# EAGLE design hbridge (EAGLE 7.4.0)
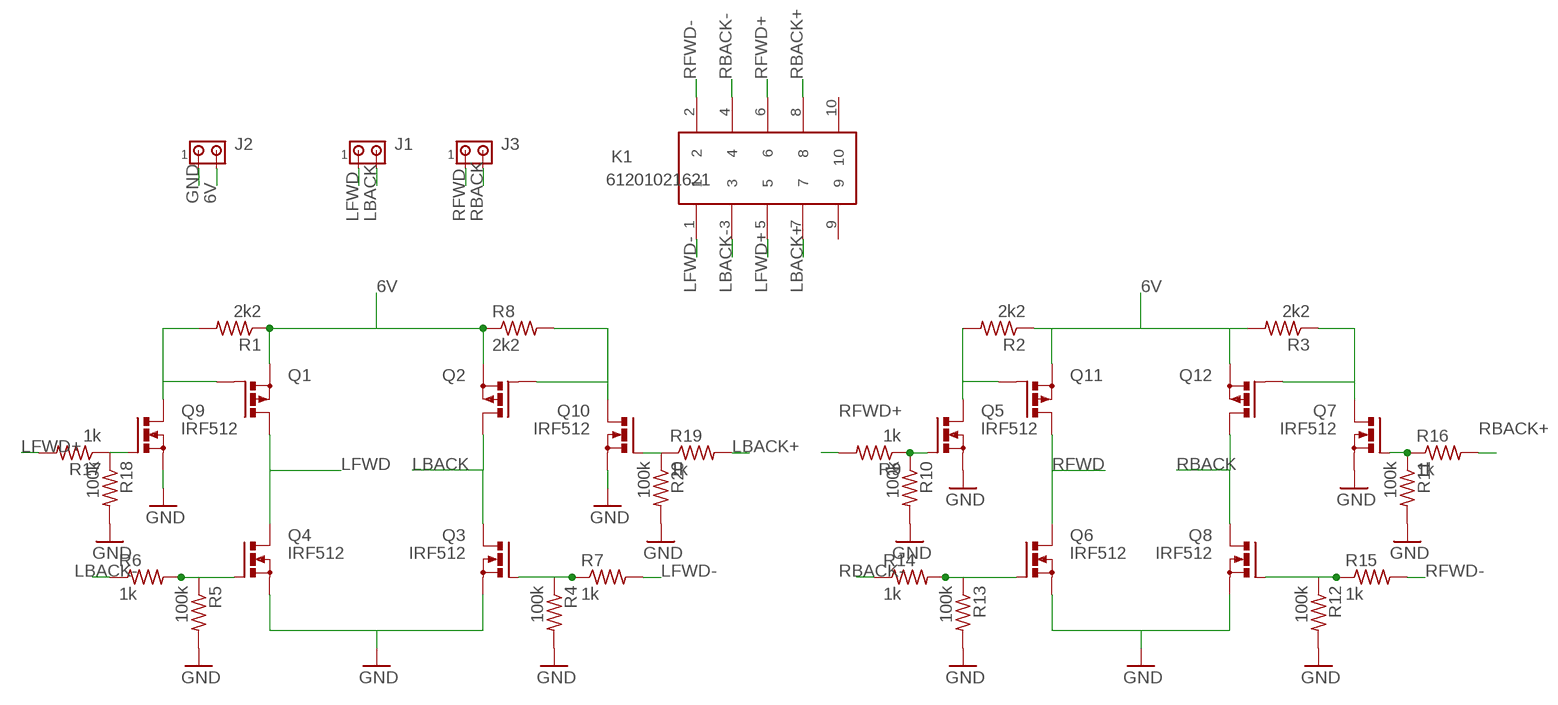
[diagram p0: schematic, sheet 1]

## Parts
J1  MTA02-100  [10X02MTA]
J2  MTA02-100  [10X02MTA]
J3  MTA02-100  [10X02MTA]
K1  61201021621  [61201021621]
Q1  PMOSFET_PTO220BV  [TO220BV]
Q2  PMOSFET_PTO220BV  [TO220BV]
Q3  IRF512  [TO220BV]
Q4  IRF512  [TO220BV]
Q5  IRF512  [TO220BV]
Q6  IRF512  [TO220BV]
Q7  IRF512  [TO220BV]
Q8  IRF512  [TO220BV]
Q9  IRF512  [TO220BV]
Q10  IRF512  [TO220BV]
Q11  PMOSFET_PTO220BV  [TO220BV]
Q12  PMOSFET_PTO220BV  [TO220BV]
R1  2k2  R-US_0204/7  [0204/7]
R2  2k2  R-US_0204/7  [0204/7]
R3  2k2  R-US_0204/7  [0204/7]
R4  100k  R-US_0204/7  [0204/7]
R5  100k  R-US_0204/7  [0204/7]
R6  1k  R-US_0204/7  [0204/7]
R7  1k  R-US_0204/7  [0204/7]
R8  2k2  R-US_0204/7  [0204/7]
R9  1k  R-US_0204/7  [0204/7]
R10  100k  R-US_0204/7  [0204/7]
R11  100k  R-US_0204/7  [0204/7]
R12  100k  R-US_0204/7  [0204/7]
R13  100k  R-US_0204/7  [0204/7]
R14  1k  R-US_0204/7  [0204/7]
R15  1k  R-US_0204/7  [0204/7]
R16  1k  R-US_0204/7  [0204/7]
R17  1k  R-US_0204/7  [0204/7]
R18  100k  R-US_0204/7  [0204/7]
R19  1k  R-US_0204/7  [0204/7]
R20  100k  R-US_0204/7  [0204/7]

## Nets
6V: J2.2 Q1.S Q2.S Q11.S Q12.S R1.1 R2.1 R3.2 R8.1
GND: J2.1 Q3.S Q4.S Q5.S Q6.S Q7.S Q8.S Q9.S Q10.S R4.2 R5.2 R10.2 R11.2 R12.2 R13.2 R18.2 R20.2
LBACK: J1.2 Q2.D Q3.D
LBACK+: K1.7 R19.2
LBACK-: K1.3 R6.1
LFWD: J1.1 Q1.D Q4.D
LFWD+: K1.5 R17.2
LFWD-: K1.1 R7.2
N$1: Q3.G R4.1 R7.1
N$2: Q2.G Q10.D R8.2
N$3: Q4.G R5.1 R6.2
N$4: Q1.G Q9.D R1.2
N$5: Q8.G R12.1 R15.1
N$6: Q7.G R11.1 R16.1
N$7: Q6.G R13.1 R14.2
N$8: Q5.G R9.1 R10.1
N$9: Q5.D Q11.G R2.2
N$10: Q10.G R19.1 R20.1
N$11: Q9.G R17.1 R18.1
N$12: Q7.D Q12.G R3.1
RBACK: J3.2 Q8.D Q12.D
RBACK+: K1.8 R16.2
RBACK-: K1.4 R14.1
RFWD: J3.1 Q6.D Q11.D
RFWD+: K1.6 R9.2
RFWD-: K1.2 R15.2
Unconnected: K1.9 K1.10

## Library data of the parts
J1-J3 = con-amp:MTA02-100: AMP connector
K1 = Wurth_Elektronik_Electromechanic_Wire_to_Board_Connectors_rev15c:61201021621: WR-BHD 2.54mm Male Box Header, 10 Pins=>Code : Con_WTB_BHD_2.54_Male_THT_WS_61201021621 <http://katalog.we-online.de/media/thumbs2/eican/thb_Con_WTB_BHD_2.54_Male_THT_WS_6120xx21621_pf2.jpg> Details see: http://katalog.we-online.de/en/em/612_0xx_216_21 Created 2014-06-04, Karrer Zheng 2014 (C) Würth Elektronik
Q1 Q2 Q11 Q12 = transistor-power:PMOSFET_P: Power MOSFET P-Channel
Q3-Q10 = transistor-power:IRF512: N-CHANNEL MOS FET
R1-R20 = rcl:R-US_: RESISTOR, American symbol

## Board
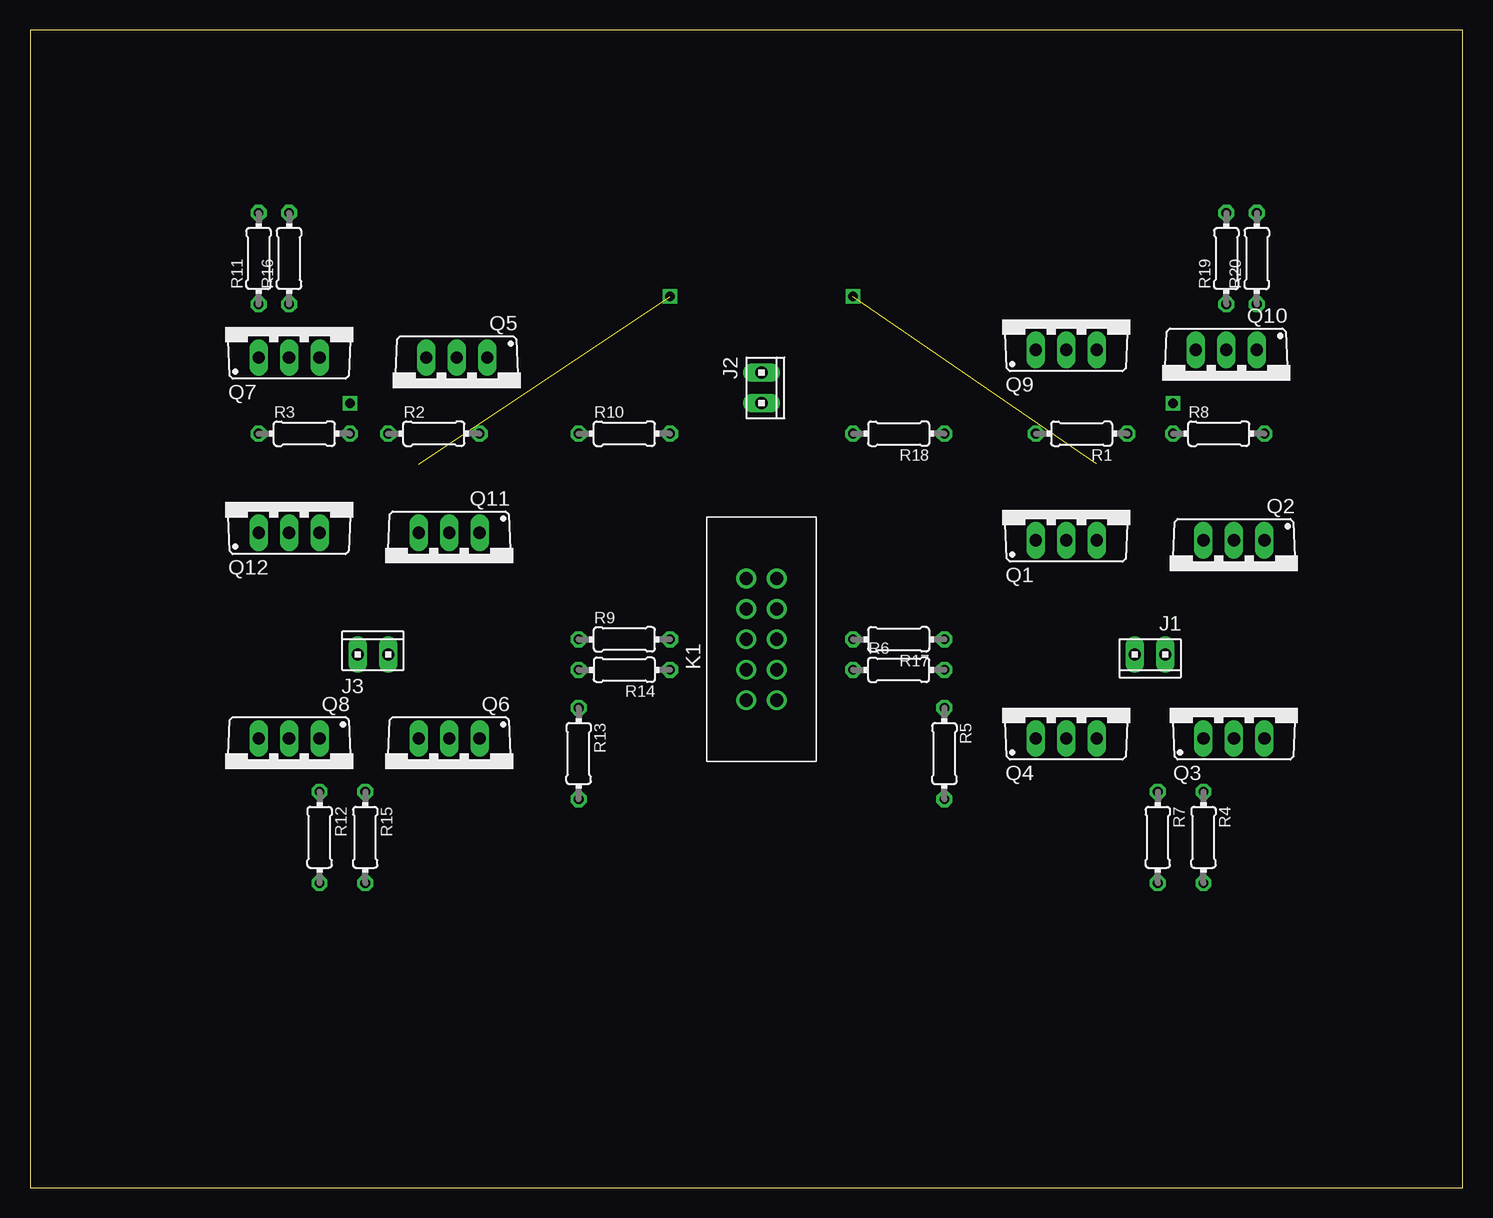
[diagram p1: board, top side]
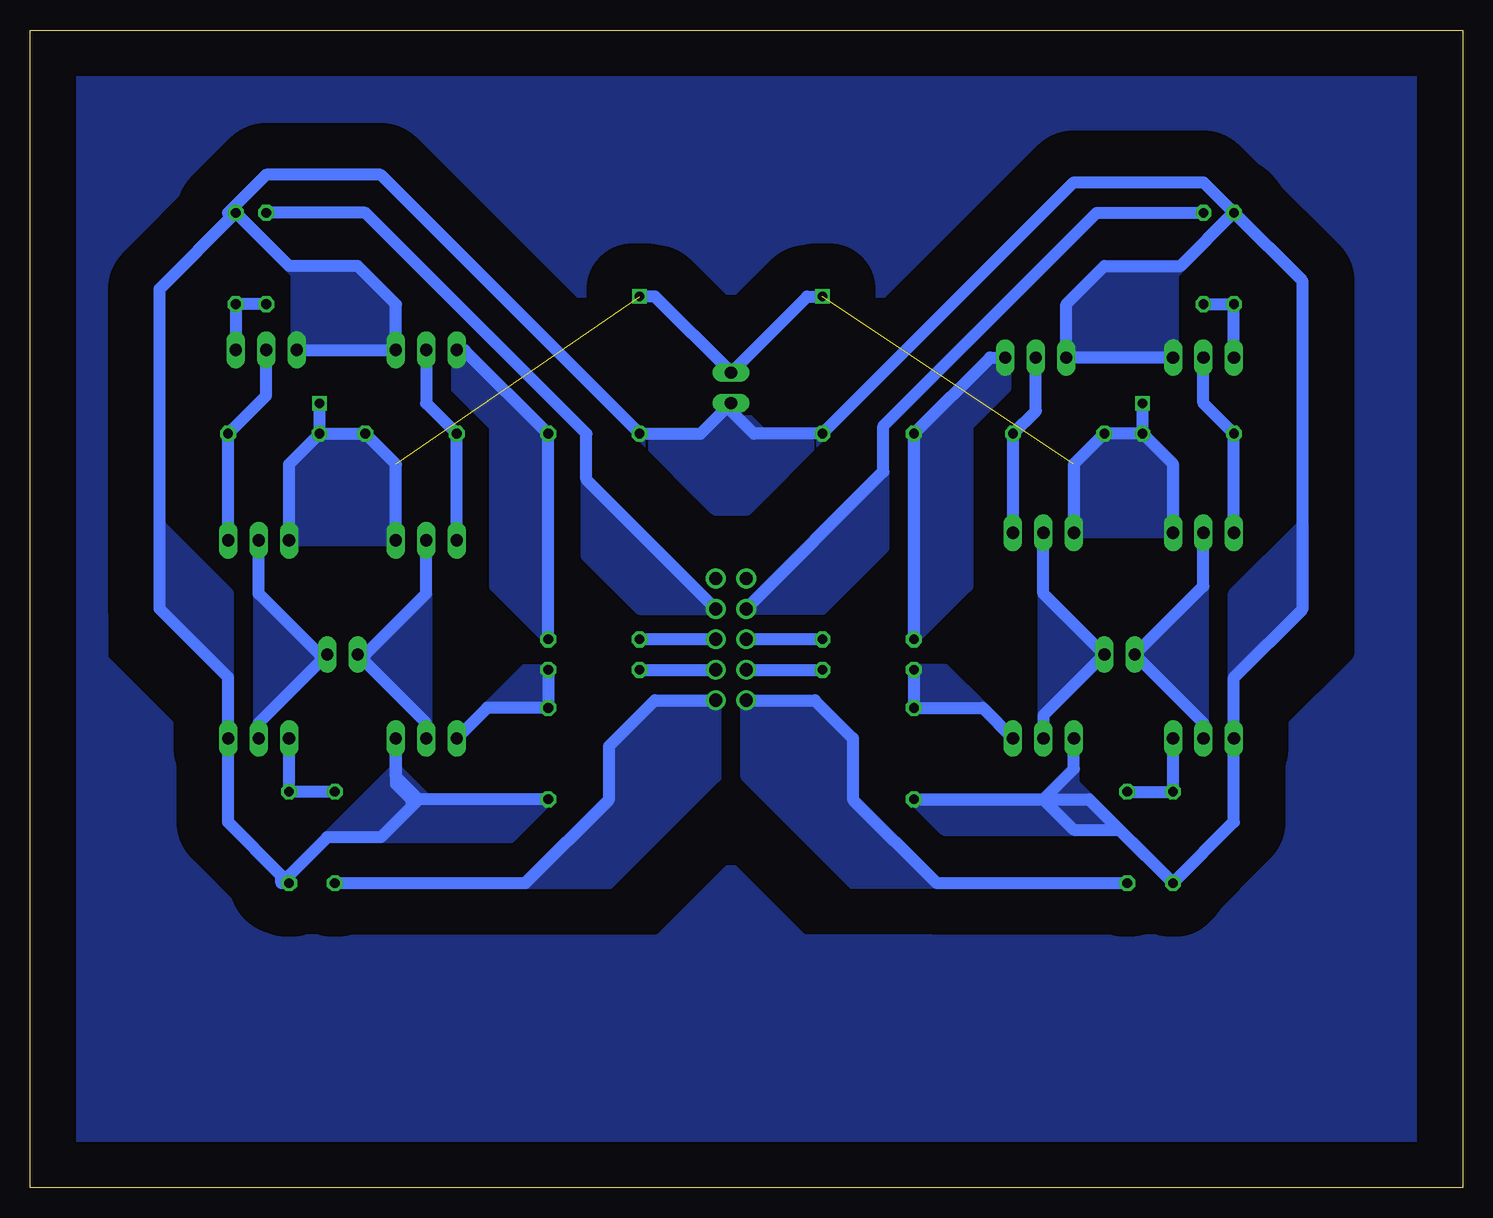
[diagram p2: board, bottom side, seen from below]

Size 119.38 x 96.52 mm. Coordinates in mm from the lower left corner, seen from the top.
Outline: 0,0 119.38,0 119.38,96.52 0,96.52 0,0
Copper layers (1*16): Top 0.035mm / dielectric 1.5mm / Bottom 0.035mm
Design rules "default": minimum track width 10mil, minimum drill 24mil, track to track 8mil, track to pad 8mil, pad to pad 8mil, via to via 8mil, smd to smd 8mil, copper to edge 40mil, drill to drill 8mil, minimum pad ring 10mil, minimum via ring 8mil, stop-mask expansion 4mil, vias tented up to drill 0mil, thermal gap 10mil

### Footprints (pad centres in the part's own frame; a part is rotated, then mirrored left to right if it is on the bottom)
10X02MTA = drill 1.016 long: 1 1.27,0; 2 -1.27,0
61201021621 = drill 1.1: 1 -2.54,-1.27; 2 -2.54,1.27; 3 0,-1.27; 4 0,1.27; 5 2.54,-1.27; 6 2.54,1.27; 7 5.08,-1.27; 8 5.08,1.27; 9 7.62,-1.27; 10 7.62,1.27
TO220BV = drill 1.016 long: D 0,-2.54; G -2.54,-2.54; S 2.54,-2.54
0204/7 = drill 0.813 octagon: 1 -3.81,0; 2 3.81,0

### Placement (x,y rotation side)
J1  93.34,44.45 180 top
J2  60.96,66.67 270 top
J3  28.57,44.45 0 top
K1  60.96,43.18 90 top
Q1  86.36,56.52 0 top
Q2  100.33,51.44 180 top
Q3  100.33,40.01 0 top
Q4  86.36,40.01 0 top
Q5  35.56,66.67 180 top
Q6  34.92,34.92 180 top
Q7  21.59,71.75 0 top
Q8  21.59,34.92 180 top
Q9  86.36,72.39 0 top
Q10  99.7,67.31 180 top
Q11  34.92,52.07 180 top
Q12  21.59,57.15 0 top
R1  87.63,62.87 180 top
R2  33.66,62.87 0 top
R3  22.86,62.87 0 top
R4  97.79,29.21 270 top
R5  76.2,36.2 270 top
R6  72.39,43.18 0 top
R7  93.98,29.21 270 top
R8  99.06,62.87 0 top
R9  49.53,45.72 0 top
R10  49.53,62.87 0 top
R11  19.05,77.47 90 top
R12  24.13,29.21 270 top
R13  45.72,36.2 270 top
R14  49.53,43.18 180 top
R15  27.94,29.21 270 top
R16  21.59,77.47 90 top
R17  72.39,45.72 180 top
R18  72.39,62.87 180 top
R19  99.7,77.47 90 top
R20  102.23,77.47 90 top

### Tracks (layer width: path | path; a pad name or v marks a point on that pad's centre or on a via)
6V  (via drill 0.8)  (2 unrouted)
  Bottom 1.016: v53.34,74.3 54.61,74.3 J2.2 67.31,74.3 v68.58,74.3 | R3.2 v26.67,65.41 | Q1.S 88.9,60.33 R1.1 R8.1 | Q12.S 24.13,60.33 R3.2 | R3.2 R2.1 32.38,60.33 Q11.S | R8.1 v95.25,65.41 | Q2.S 97.79,60.33 R8.1
  pour Bottom (no thermals): 24.13,54.61 32.38,54.61 32.38,60.33 29.84,62.87 26.67,62.87 24.13,60.33
  pour Bottom (no thermals): 97.79,53.98 97.79,60.33 95.25,62.87 91.44,62.87 88.9,60.33 88.9,53.98
GND
  Bottom 1.016: 87,32.38 88.9,34.29 Q4.S 88.9,33.66 87.63,32.38 87.63,31.75 | 98.42,26.04 R4.2 97.79,26.04 | 87.63,31.75 90.17,29.21 94.62,29.21 97.79,26.04 | 97.79,26.04 98.42,25.4 98.42,26.04 | 34.92,32.38 R13.2 31.11,32.38 R12.2 | 34.92,32.38 32.38,29.84 28.57,29.84 R12.2 | 34.92,32.38 32.38,34.92 Q6.S | Q7.S Q5.S 33.02,73.66 29.84,76.83 23.49,76.83 R11.2 | R12.2 19.05,30.48 Q8.S 19.05,42.55 13.33,48.26 13.33,75.56 R11.2 | R11.2 21.59,83.82 32.38,83.82 R10.2 59.05,62.87 61.59,65.41 J2.1 63.5,62.87 R18.2 90.17,84.45 99.7,84.45 102.87,81.28 R20.2 | Q10.S Q9.S 88.9,73.66 92.08,76.83 97.79,76.83 R20.2 | R5.2 87,32.38 | 87,32.38 87.63,31.75 | 98.42,26.04 102.87,30.48 Q3.S 102.87,42.55 108.59,48.26 108.59,74.93 R20.2
  pour Bottom (no thermals): 19.05,42.55 19.05,49.53 13.33,55.24 13.33,48.26
  pour Bottom (no thermals): 28.57,29.84 32.38,33.66 32.38,34.92 34.92,32.38 45.72,32.38 43.18,29.84
  pour Bottom (no thermals): 24.13,69.22 24.13,76.2 23.49,76.83 29.84,76.83 33.02,73.66 33.02,69.22
  pour Bottom (no thermals): 97.16,69.85 97.16,76.2 97.79,76.83 92.08,76.83 88.9,73.66 88.9,69.85
  pour Bottom (no thermals): 76.2,32.38 79.38,29.21 94.62,29.21 88.9,34.92 86.36,32.38
  pour Bottom: 102.87,42.55 102.87,49.53 108.59,55.24 108.59,48.26
  pour Bottom: 53.34,62.87 59.69,56.52 62.23,56.52 68.58,62.87 63.5,62.87 60.96,65.41 58.42,62.87
LBACK
  Bottom 1.016: Q3.D 100.33,38.73 J1.2 95.25,44.45 100.33,49.53 Q2.D
  pour Bottom (no thermals): 100.33,49.53 100.33,38.73 94.62,44.45 95.25,44.45
LBACK+
  Bottom 1.016: K1.7 73.03,59.05 73.03,62.87 91.44,81.28 R19.2
  pour Bottom (no thermals): 73.03,59.05 73.03,52.7 68.58,48.26 62.23,48.26
LBACK-
  Bottom 1.016: R6.1 K1.3
LFWD
  Bottom 1.016: Q4.D 86.36,38.73 J1.1 91.44,44.45 86.36,49.53 Q1.D
  pour Bottom (no thermals): 86.36,49.53 86.36,38.73 92.08,44.45 91.44,44.45
LFWD+
  Bottom 1.016: K1.5 R17.2
LFWD-
  Bottom 1.016: R7.2 78.11,25.4 71.12,32.38 71.12,36.83 67.31,40.64 K1.1
  pour Bottom (no thermals): 78.11,25.4 71.12,25.4 62.23,34.29 62.23,40.64 67.31,40.64 71.12,36.83 71.12,32.38
N$1
  Bottom 1.016: R7.1 R4.1 Q3.G
N$2
  Bottom 1.016: Q2.G R8.2 99.7,66.04 Q10.D
N$3
  Bottom 1.016: R6.2 R5.1 81.28,40.01 Q4.G
  pour Bottom (no thermals): 81.28,40.01 78.11,43.18 76.2,43.18 76.2,40.01
N$4
  Bottom 1.016: Q1.G R1.2 86.36,65.41 Q9.D
N$5
  Bottom 1.016: R15.1 R12.1 Q8.G
N$6
  Bottom 1.016: R16.1 R11.1 Q7.G
N$7
  Bottom 1.016: R14.2 R13.1 40,40.01 Q6.G
  pour Bottom (no thermals): 40,40.01 43.18,43.18 45.72,43.18 45.72,40.01
N$8
  Bottom 1.016: R9.1 R10.1 39.37,69.22 Q5.G
  pour Bottom (no thermals): 38.1,69.22 38.1,66.67 41.27,63.5 41.27,50.16 45.72,45.72 45.72,62.87 39.37,69.22
N$9
  Bottom 1.016: Q11.G R2.2 35.56,64.77 Q5.D
N$10
  Bottom 1.016: R19.1 R20.1 Q10.G
N$11
  Bottom 1.016: R17.1 R18.1 83.19,69.85 Q9.G
  pour Bottom (no thermals): 83.82,69.85 83.82,66.67 80.64,63.5 80.64,50.16 76.2,45.72 76.2,62.23
N$12
  Bottom 1.016: Q12.G R3.1 21.59,65.41 Q7.D
N$13
  pour Bottom (isolate 3.81, rank 2, no thermals): 116.84,1.91 1.9,1.91 1.9,95.25 116.84,95.25
RBACK
  Bottom 1.016: Q8.D 21.59,38.73 J3.2 21.59,50.16 Q12.D
  pour Bottom (no thermals): 21.59,50.16 27.3,44.45 21.59,38.73
RBACK+
  Bottom 1.016: K1.8 48.26,59.69 48.26,63.5 30.48,81.28 R16.2
  pour Bottom (no thermals): 48.26,59.69 48.26,53.34 53.34,48.26 59.69,48.26
RBACK-
  Bottom 1.016: K1.4 R14.1
RFWD
  Bottom 1.016: Q6.D 34.92,39.37 J3.1 34.92,49.53 Q11.D
  pour Bottom (no thermals): 34.92,49.53 34.92,39.37 29.84,44.45
RFWD+
  Bottom 1.016: R9.2 K1.6
RFWD-
  Bottom 1.016: K1.2 53.97,40.64 50.8,37.47 50.8,32.38 43.81,25.4 R15.2
  pour Bottom (no thermals): 43.81,25.4 50.8,25.4 59.69,34.29 59.69,40.64 53.97,40.64 50.8,37.47 50.8,32.38